# EAGLE design SpecialMechanism (EAGLE 9.1.3)
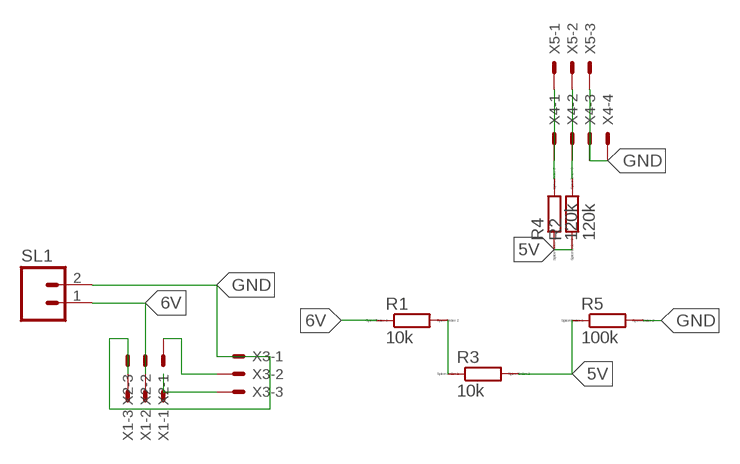
[diagram p0: schematic, sheet 1]

## Parts
R1  10k  R0207/10  [0207/10]
R2  120k  R0207/10  [0207/10]
R3  10k  R0207/10  [0207/10]
R4  120k  R0207/10  [0207/10]
R5  100k  R0207/10  [0207/10]
SL1  M02  [02P]
X1  KK-156-3  [KK-156-3]
X2  KK-156-3  [KK-156-3]
X3  KK-156-3  [KK-156-3]
X4  KK-156-4  [KK-156-4]
X5  KK-156-3  [KK-156-3]

## Nets
5V: R2.1 R3.2 R4.1 R5.1
6V: R1.1 SL1.1 X1.2 X2.2
GND: R5.2 SL1.2 X1.3 X2.3 X3.1 X4.3 X4.4 X5.3
N$2: R1.2 R3.1
N$3: X1.1 X3.3
N$4: X2.1 X3.2
N$6: R4.2 X4.1 X5.1
N$7: R2.2 X4.2 X5.2

## Library data of the parts
R1-R5 = eagle-ltspice:R: RESISTOR, European symbol; SPICEMODEL: NONE; SPICEPREFIX: R
SL1 = con-amp-quick:M02: AMP QUICK CONNECTOR; OC_FARNELL: unknown; OC_NEWARK: unknown
X1-X3 X5 = con-molex:KK-156-3: KK 156 HEADER Source: http://www.molex.com/pdm_docs/sd/026604100_sd.pdf; MF: MOLEX; OC_FARNELL: unknown; OC_NEWARK: unknown
X4 = con-molex:KK-156-4: KK 156 HEADER Source: http://www.molex.com/pdm_docs/sd/026604100_sd.pdf; MF: MOLEX; OC_FARNELL: unknown; OC_NEWARK: unknown

## Board
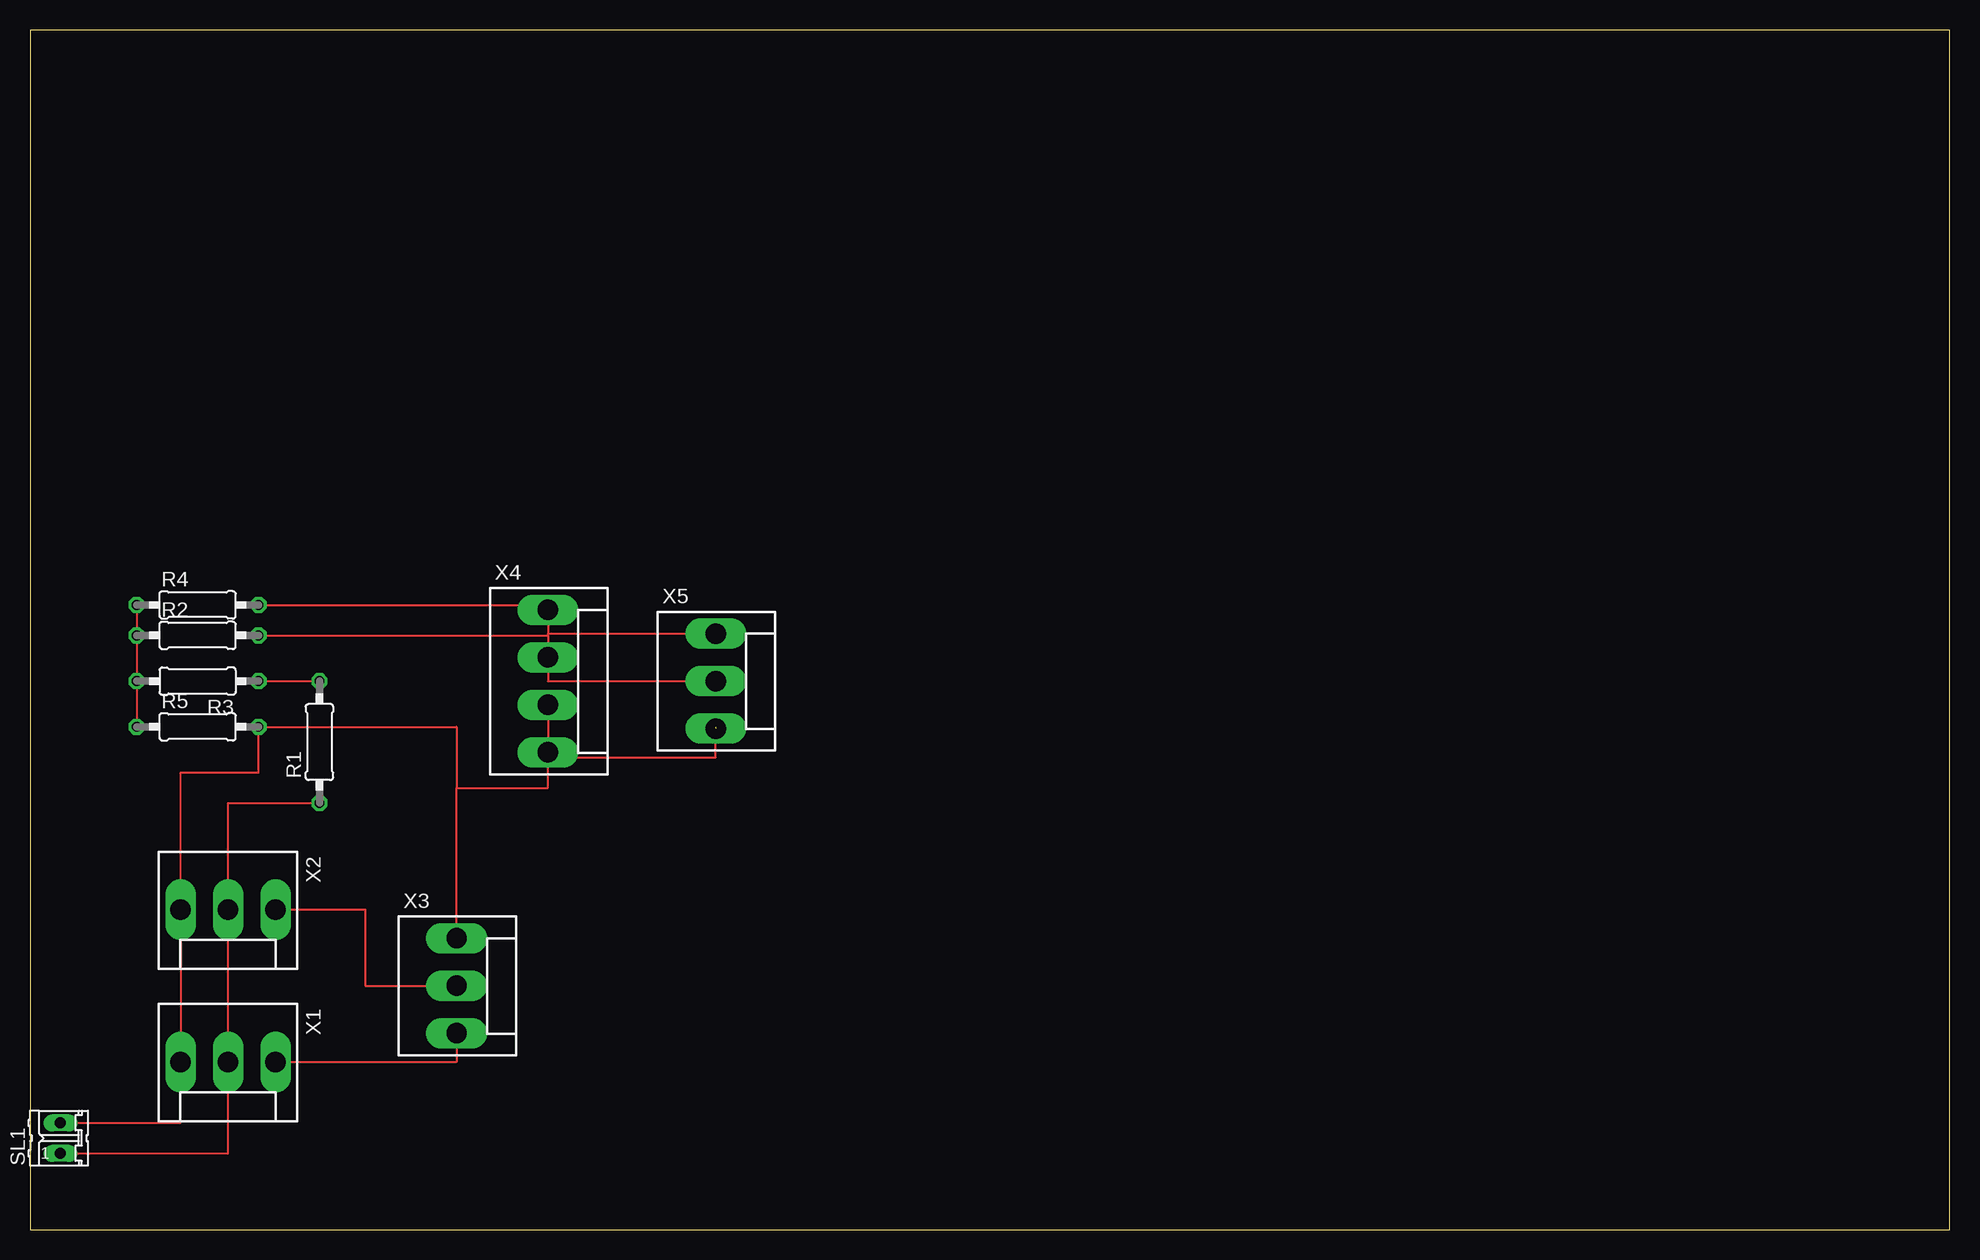
[diagram p1: board, top side]

Size 160 x 100 mm. Coordinates in mm from the lower left corner, seen from the top.
Outline: 0,0 160,0 160,100 0,100 0,0
Copper layers (1*16): Top 0.035mm / dielectric 1.5mm / Bottom 0.035mm
Design rules "default": minimum track width 6mil, minimum drill 0.35mm, track to track 6mil, track to pad 6mil, pad to pad 6mil, via to via 6mil, smd to smd 6mil, copper to edge 40mil, drill to drill 6mil, minimum pad ring 10mil, minimum via ring 8mil, stop-mask expansion 4mil, vias tented up to drill 0mil, thermal gap 10mil

### Footprints (pad centres in the part's own frame; a part is rotated, then mirrored left to right if it is on the bottom)
0207/10 = drill 0.813 octagon: 1 -5.08,0; 2 5.08,0
02P = drill 0.914 long: 1 -1.27,0; 2 1.27,0
KK-156-3 = drill 1.7 pad 2.184 long: 1 -3.96,0; 2 0,0; 3 3.96,0
KK-156-4 = drill 1.7 pad 2.184 long: 1 -5.94,0; 2 -1.98,0; 3 1.98,0; 4 5.94,0

### Placement (x,y rotation side)
R1  24.13,40.64 90 top
R2  13.97,49.53 0 top
R3  13.97,45.72 180 top
R4  13.97,52.07 0 top
R5  13.97,41.91 0 top
SL1  2.54,7.62 90 top
X1  16.51,13.97 180 top
X2  16.51,26.67 180 top
X3  35.56,20.32 270 top
X4  43.18,45.72 270 top
X5  57.15,45.72 270 top

### Tracks (layer width: path | path; a pad name or v marks a point on that pad's centre or on a via)
5V
  Top 0.152: R4.1 R2.1 R5.1 R3.2
6V
  Top 0.152: SL1.1 16.51,6.35 X1.2 X2.2 16.51,35.56 R1.1
GND  (1 unrouted)
  Top 0.152: SL1.2 12.55,8.89 X1.3 X2.3 12.55,38.1 19.05,38.1 R5.2 35.56,41.91 35.56,36.83 | X4.4 43.18,39.37 57.15,39.37 57.15,41.91 | X3.1 35.56,36.83 | X4.3 X4.4 | 35.56,36.83 43.18,36.83 X4.4
N$2
  Top 0.152: R3.1 R1.2
N$3
  Top 0.152: X1.1 35.56,13.97 X3.3
N$4
  Top 0.152: X2.1 27.94,26.67 27.94,20.32 X3.2
N$6
  Top 0.152: R4.2 42.77,52.07 X4.1 43.18,49.68 X5.1
N$7
  Top 0.152: R2.2 43.18,49.53 43.18,46.99 | 43.18,46.99 X4.2 | X5.2 43.18,45.72 43.18,46.99